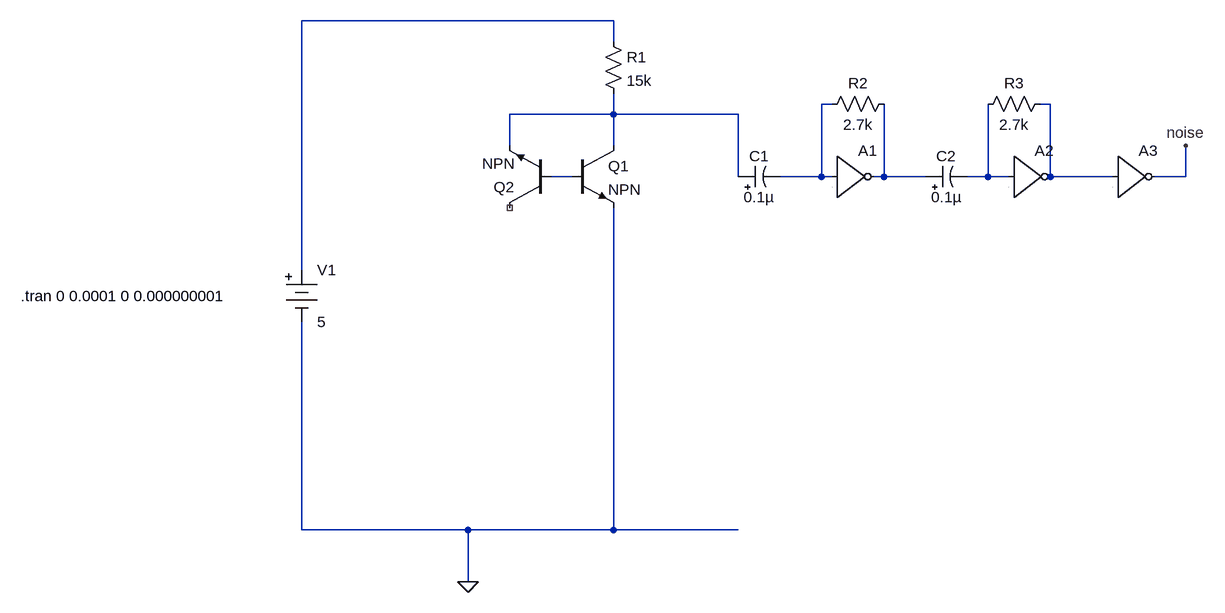
[diagram p0: schematic Noise_gen3.asc]
Noise_gen3.asc, the LTspice schematic file:
Version 4
SHEET 1 1824 680
WIRE 528 -240 48 -240
WIRE 528 -208 528 -240
WIRE 864 -112 848 -112
WIRE 1200 -112 1184 -112
WIRE 528 -96 528 -128
WIRE 528 -96 368 -96
WIRE 720 -96 528 -96
WIRE 368 -48 368 -96
WIRE 528 -48 528 -96
WIRE 464 0 432 0
WIRE 720 0 720 -96
WIRE 848 0 848 -112
WIRE 848 0 784 0
WIRE 864 0 848 0
WIRE 944 0 944 -112
WIRE 944 0 928 0
WIRE 1008 0 944 0
WIRE 1104 0 1104 -112
WIRE 1104 0 1072 0
WIRE 1136 0 1104 0
WIRE 1200 0 1200 -112
WIRE 1296 0 1200 0
WIRE 1408 0 1408 -48
WIRE 1408 0 1360 0
WIRE 48 144 48 -240
WIRE 48 544 48 224
WIRE 304 544 48 544
WIRE 528 544 528 48
WIRE 528 544 304 544
WIRE 720 544 528 544
WIRE 304 624 304 544
FLAG 304 624 0
FLAG 1408 -48 noise
SYMBOL Misc\\battery 48 128 R0
WINDOW 123 0 0 Left 2
WINDOW 39 0 0 Left 2
SYMATTR InstName V1
SYMATTR Value 5
SYMBOL npn 464 -48 R0
SYMATTR InstName Q1
SYMBOL npn 432 48 R180
SYMATTR InstName Q2
SYMBOL res 512 -224 R0
SYMATTR InstName R1
SYMATTR Value 15k
SYMBOL res 960 -128 R90
WINDOW 0 0 56 VBottom 2
WINDOW 3 32 56 VTop 2
SYMATTR InstName R2
SYMATTR Value 2.7k
SYMBOL res 1200 -128 R90
WINDOW 0 0 56 VBottom 2
WINDOW 3 32 56 VTop 2
SYMATTR InstName R3
SYMATTR Value 2.7k
SYMBOL polcap 720 16 R270
WINDOW 0 32 32 VTop 2
WINDOW 3 0 32 VBottom 2
SYMATTR InstName C1
SYMATTR Value 0.1µ
SYMBOL polcap 1008 16 R270
WINDOW 0 32 32 VTop 2
WINDOW 3 0 32 VBottom 2
SYMATTR InstName C2
SYMATTR Value 0.1µ
SYMBOL Digital\\inv 864 -64 R0
SYMATTR InstName A1
SYMBOL Digital\\inv 1136 -64 R0
SYMATTR InstName A2
SYMBOL Digital\\inv 1296 -64 R0
SYMATTR InstName A3
TEXT -384 184 Left 2 !.tran 0 0.0001 0 0.000000001

The netlist it stands for:
* Noise_gen3.asc
V1 N001 0 5
Q1 N004 N005 0 0 NPN
Q2 NC_01 N005 N004 0 NPN
R1 N001 N004 15k
R2 N006 N002 2.7k
R3 N003 N007 2.7k
C1 N004 N002 0.1µ
C2 N006 N007 0.1µ
A1 N002 0 0 0 0 N006 0 0 BUF
A2 N007 0 0 0 0 N003 0 0 BUF
A3 N003 0 0 0 0 noise 0 0 BUF
.model NPN NPN
.model PNP PNP
.lib standard.bjt
.tran 0 0.0001 0 0.000000001
.backanno
.end